# EAGLE schematic Touch Menu Board (EAGLE 6.4)
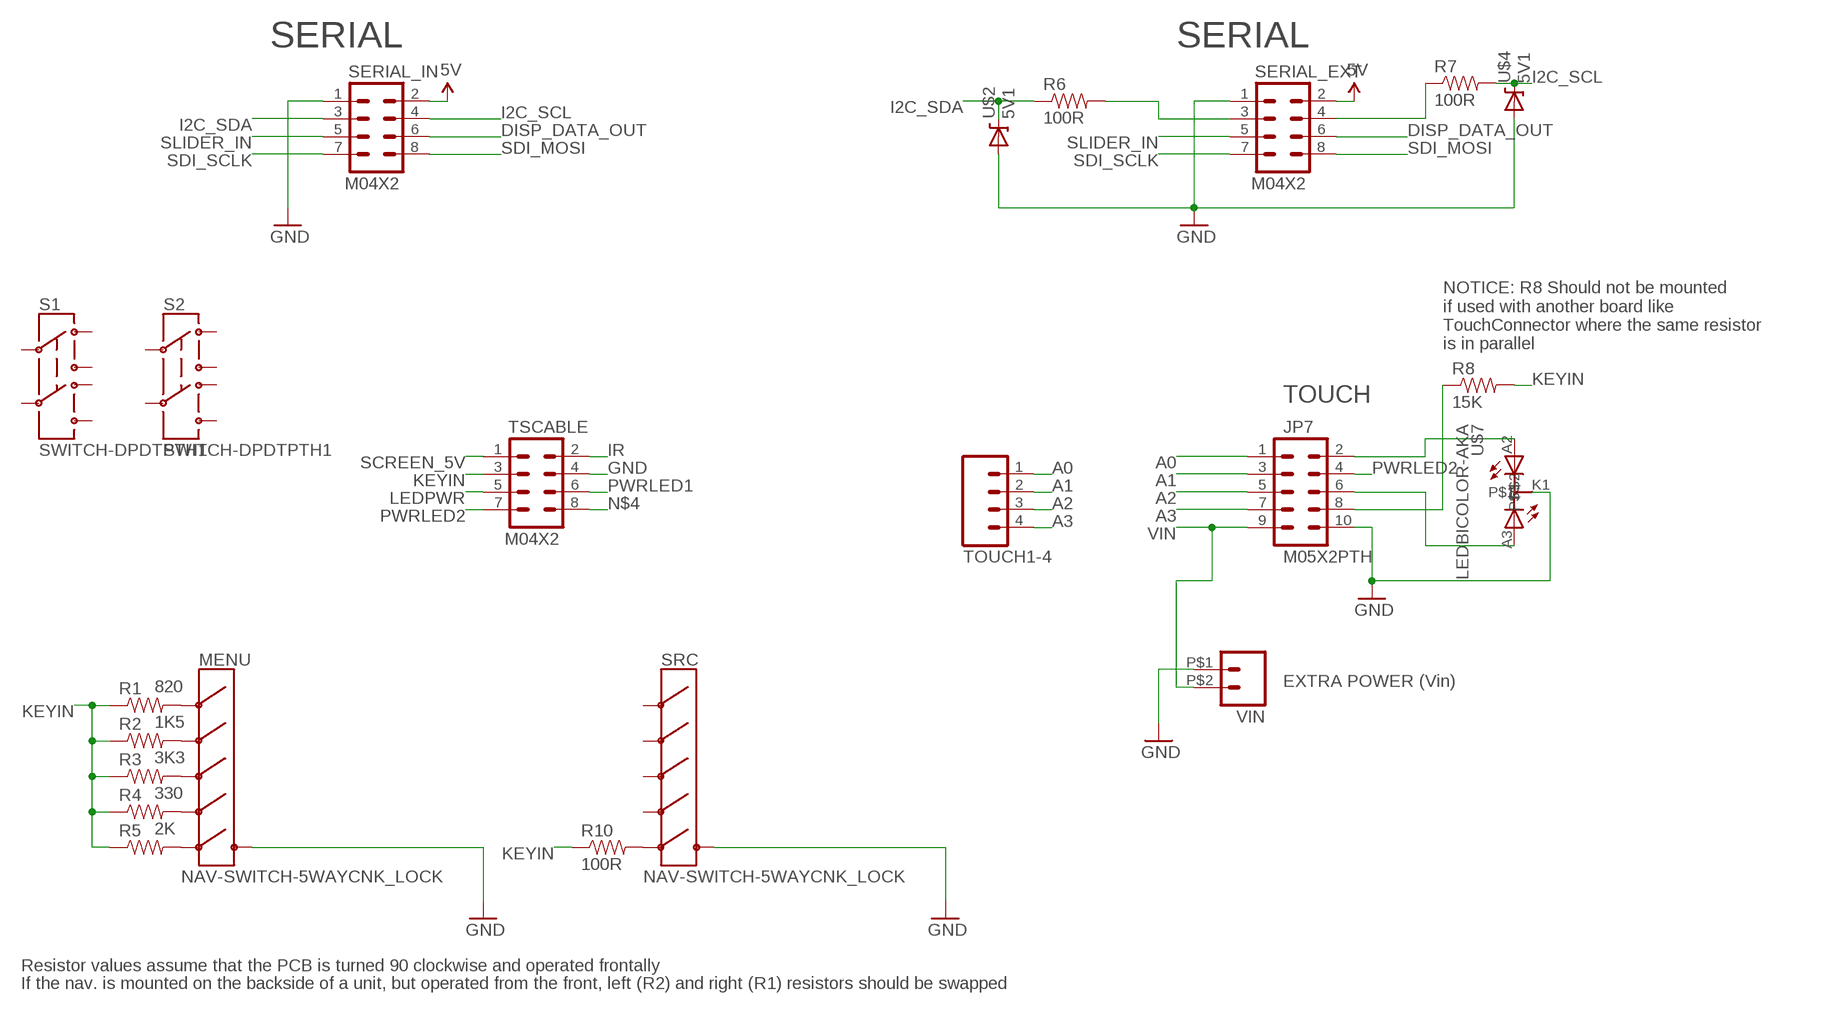
[diagram p0: schematic, sheet 1]

## Parts
JP7  M05X2PTH  [AVR_ICSP]
MENU  NAV-SWITCH-5WAYCNK_LOCK  [NAV-SWITCH-5WAY]
R1  820  RESISTOR0603-RES  [0603-RES]
R2  1K5  RESISTOR0603-RES  [0603-RES]
R3  3K3  RESISTOR0603-RES  [0603-RES]
R4  330  RESISTOR0603-RES  [0603-RES]
R5  2K  RESISTOR0603-RES  [0603-RES]
R6  100R  RESISTOR0603-RES  [0603-RES]
R7  100R  RESISTOR0603-RES  [0603-RES]
R8  15K  RESISTOR0603-RES  [0603-RES]
R10  100R  RESISTOR0603-RES  [0603-RES]
S1  SWITCH-DPDTPTH1  [TECONNECTIVITY-DPDT]
S2  SWITCH-DPDTPTH1  [TECONNECTIVITY-DPDT]
SERIAL_EXT  M04X2  [2X4]
SERIAL_IN  M04X2  [2X4]
SRC  NAV-SWITCH-5WAYCNK_LOCK  [NAV-SWITCH-5WAY]
TOUCH1-4  M04PTH  [1X04]
TSCABLE  M04X2  [2X4]
U$2  5V1  DIODE-ZENERPTH  [DIODE-ZENER]
U$4  5V1  DIODE-ZENERPTH  [DIODE-ZENER]
U$7  LEDBICOLOR-AKA  [LED5MM-BICOLOR]
VIN  M02PTH2  [1X02_BIG]

## Nets
5V [Power]: SERIAL_EXT.2 SERIAL_IN.2
A0: JP7.1 TOUCH1-4.1
A1: JP7.3 TOUCH1-4.2
A2: JP7.5 TOUCH1-4.3
A3: JP7.7 TOUCH1-4.4
DISP_DATA_OUT: SERIAL_EXT.6 SERIAL_IN.6
GND [Power]: JP7.10 MENU.PIN4(COMMON) SERIAL_EXT.1 SERIAL_IN.1 SRC.PIN4(COMMON) TSCABLE.4 U$2.P$2(A) U$4.P$2(A) U$7.K1 VIN.P$1
I2C_SCL: R7.2 SERIAL_IN.4 U$4.P$1(C)
I2C_SDA: R6.1 SERIAL_IN.3 U$2.P$1(C)
IR: TSCABLE.2
KEYIN: R1.1 R2.1 R3.1 R4.1 R5.1 R8.2 R10.1 TSCABLE.3
LEDPWR: TSCABLE.5
N$1: R6.2 SERIAL_EXT.3
N$2: MENU.PIN1(UP) R1.2
N$3: MENU.PIN3(DWN) R2.2
N$4: TSCABLE.8
N$5: MENU.PIN2(LEFT) R3.2
N$6: MENU.PIN5(RIGHT) R4.2
N$7: JP7.2 U$7.A2
N$8: JP7.6 U$7.A3
N$9: MENU.PIN6(PUSH) R5.2
N$11: JP7.8 R8.1
N$13: R10.2 SRC.PIN6(PUSH)
N$14: R7.1 SERIAL_EXT.4
PWRLED1: TSCABLE.6
PWRLED2: JP7.4 TSCABLE.7
SCREEN_5V [Power]: TSCABLE.1
SDI_MOSI: SERIAL_EXT.8 SERIAL_IN.8
SDI_SCLK: SERIAL_EXT.7 SERIAL_IN.7
SLIDER_IN: SERIAL_EXT.5 SERIAL_IN.5
VIN [Power]: JP7.9 VIN.P$2
Unconnected: S1.P$1 S1.P$2 S1.P$3 S1.P$4 S1.P$5 S1.P$6 S2.P$1 S2.P$2 S2.P$3 S2.P$4 S2.P$5 S2.P$6 SRC.PIN1(UP) SRC.PIN2(LEFT) SRC.PIN3(DWN) SRC.PIN5(RIGHT)

## Notes on the sheet
- SERIAL | SERIAL
- NOTICE: R8 Should not be mounted
  if used with another board like
  TouchConnector where the same resistor
  is in parallel
- TOUCH
- EXTRA POWER (Vin)
- Resistor values assume that the PCB is turned 90 clockwise and operated frontally
- If the nav. is mounted on the backside of a unit, but operated from the front, left (R2) and right (R1) resistors should be swapped

## Library data of the parts
JP7 = SparkFun:M05X2: Header 5x2 Standard 10-pin dual row 0.1" header. Commonly used with AVR-ISP. Use with Spark Fun Electronics SKU: PRT-00778
MENU SRC = SKAARHOJ:NAV-SWITCH-5WAY: For use with a push-button switch made by CnK components. The Part # is
R1-R8 R10 = SparkFun:RESISTOR: Resistor Basic schematic elements and footprints for 0603, 1206, and PTH resistors.
S1 S2 = SKAARHOJ:SWITCH-DPDT: DPDT Version of the COM-00597
SERIAL_EXT SERIAL_IN TSCABLE = SparkFun:M04X2
TOUCH1-4 = SparkFun:M04: Header 4 Standard 4-pin 0.1" header. Use with straight break away headers (SKU : PRT-00116), right angle break away headers (PRT-00553), swiss pins (PRT-00743), machine pins (PRT-00117), and female headers (PRT-00115). Molex polarized connector foot print use with SKU : PRT-08231 with associated crimp pins and housings. 1MM SMD Version SKU: PRT-10208
U$2 U$4 = SparkFun:DIODE-ZENER: Zener Diode Production Part - 8199 3.4V Zener Voltage
U$7 = SKAARHOJ:LEDBICOLOR-AKA
VIN = SparkFun:M02: Header 2 Standard 2-pin 0.1" header. Use with straight break away headers (SKU : PRT-00116), right angle break away headers (PRT-00553), swiss pins (PRT-00743), machine pins (PRT-00117), and female headers (PRT-00115). Molex polarized connector foot print use with SKU : PRT-08233 with associated crimp pins and housings.

## Net classes
0 default: width 0.203 mm, drill 0.61 mm, clearance 0.203 mm
1 Power: width 0.406 mm, drill 0.61 mm, clearance 0.305 mm